# EasyEDA Pro project ProPrj_Inverted_MAML_6x6_2026-07-20.epro, schematic 8xDAC_WEIGHT
Create Date: 2026-06-15; Page Name: P1; Project Name: Inverted_MAML_6x6; Schematic Name: Schematic1; Update Date: 2026-06-15; Company: EasyEDA.com; Drawn: Olle Welin; Page Size: A4; Version: V1.0
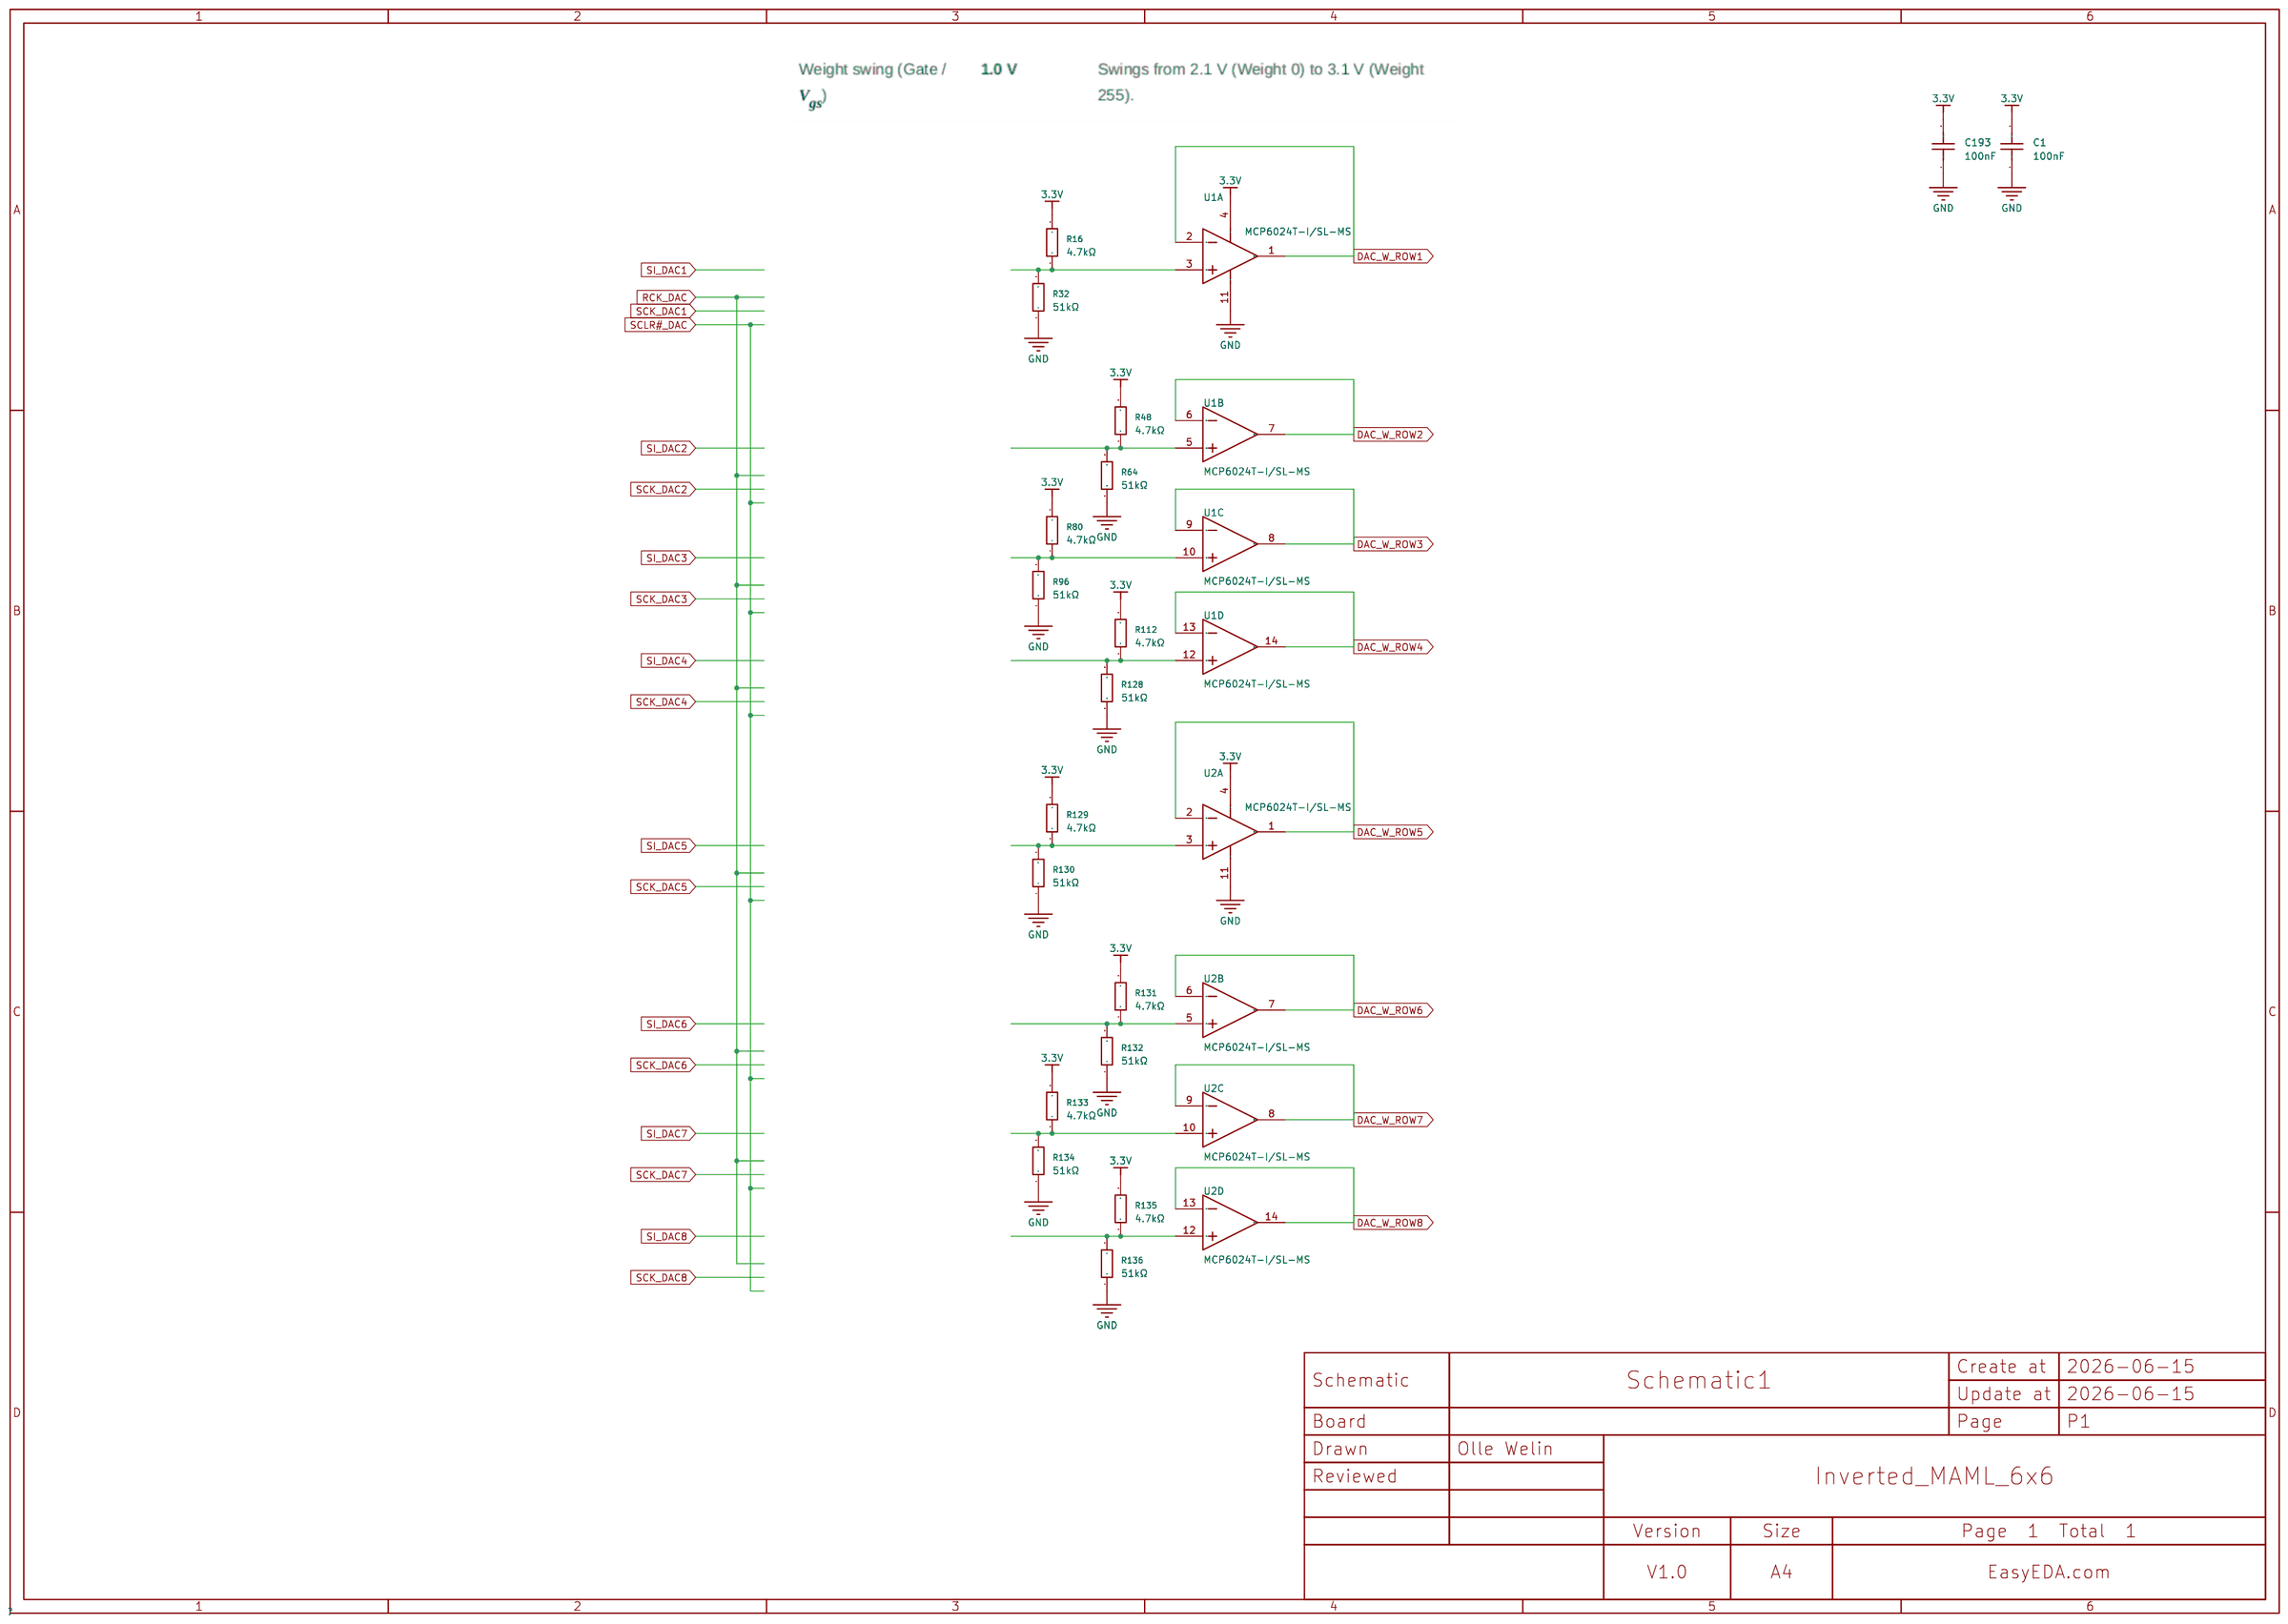
[diagram p8: schematic sheet]

## Parts
C1  100nF  [C0402]
C193  100nF  [C0402]
CBB1  -
CBB2  -
CBB3  -
CBB4  -
CBB5  -
CBB6  -
CBB7  -
CBB8  -
R16  4.7kΩ  [R0402]
R32  51kΩ  [R0402]
R48  4.7kΩ  [R0402]
R64  51kΩ  [R0402]
R80  4.7kΩ  [R0402]
R96  51kΩ  [R0402]
R112  4.7kΩ  [R0402]
R128  51kΩ  [R0402]
R129  4.7kΩ  [R0402]
R130  51kΩ  [R0402]
R131  4.7kΩ  [R0402]
R132  51kΩ  [R0402]
R133  4.7kΩ  [R0402]
R134  51kΩ  [R0402]
R135  4.7kΩ  [R0402]
R136  51kΩ  [R0402]
U1  MCP6024T-I/SL-MS  [SOIC-14_L8.7-W3.9-P1.27-LS6.0-BL-1]  (sections 1,2,3,4)
U2  MCP6024T-I/SL-MS  [SOIC-14_L8.7-W3.9-P1.27-LS6.0-BL-1]  (sections 1,2,3,4)

## Library data of the parts
C1 C193 = CL05B104KO5NNNC: Capacitance:100nF Tolerance:±10% Tolerance:±10% Voltage Rating:16V Temperature Coefficient:X7R; LCSC Part Name: 100nF ±10% 16V; Supplier Part: C1525; Manufacturer: SAMSUNG(三星); Supplier Footprint: 0402; JLCPCB Part Class: Basic Part; Datasheet: https://item.szlcsc.com/datasheet/CL05B104KO5NNNC/1877.html; Supplier: LCSC; Tolerance: ±10%; Voltage Rating: 16V; Temperature Coefficient: X7R
R16 R48 R80 R112 R129 R131 R133 R135 = 0402WGF4701TCE: Type:Thick Film Resistor Resistance:4.7kΩ Tolerance:±1% Tolerance:±1% Power(Watts):62.5mW Voltage-Supply(Max):50V Temperature Coefficient:±100ppm/℃ Temperature Coefficient:±100ppm/℃ Operating Temperature:-55℃~+155℃ Operating Temperature:-55℃~+155℃; LCSC Part Name: 4.7kΩ ±1% 62.5mW 厚膜电阻; Supplier Part: C25900; Manufacturer: UNI-ROYAL(厚声); Supplier Footprint: 0402; JLCPCB Part Class: Basic Part; Datasheet: https://item.szlcsc.com/datasheet/0402WGF4701TCE/26643.html; Supplier: LCSC; Type: Thick Film Resistor; Tolerance: ±1%; Power(Watts): 62.5mW; Voltage-Supply(Max): 50V; Temperature Coefficient: ±100ppm/℃; Operating Temperature: -55℃~+155℃
R32 R64 R96 R128 R130 R132 R134 R136 = 0402WGF5102TCE: Type:Thick Film Resistors Resistance:51kΩ Tolerance:±1% Tolerance:±1% Power(Watts): Overload Voltage (Max): Temperature Coefficient:±100ppm/℃ Temperature Coefficient:±100ppm/℃ Operating Temperature Range:-55℃~+155℃ Operating Temperature Range:-55℃~+155℃; LCSC Part Name: 51kΩ ±1% 62.5mW 厚膜电阻; Supplier Part: C25794; Manufacturer: UNI-ROYAL(厚声); Supplier Footprint: 0402; JLCPCB Part Class: Basic Part; Datasheet: https://atta.szlcsc.com/upload/public/pdf/source/20200306/C422600_1E6D84923E4A46A82E41ADD87F860B5C.pdf; Supplier: LCSC; Type: Thick Film Resistors; Tolerance: ±1%; Temperature Coefficient: ±100ppm/℃; Operating Temperature Range: -55℃~+155℃
U1 U2 = MCP6024T-I/SL-MS: Supplier Part: C54539958; Manufacturer: MSKSEMI(美森科); Supplier Footprint: SOP-14; JLCPCB Part Class: Extended Part; Datasheet: https://item.szlcsc.com/datasheet/MCP6024T-I%252FSL-MS/57895720.html; Supplier: LCSC

## Nets
3.3V: C1.2 C193.2 R16.2 R48.2 R80.2 R112.2 R129.2 R131.2 R133.2 R135.2 U1.4(V+) U2.4(V+)
GND: C1.1 C193.1 R32.1 R64.1 R96.1 R128.1 R130.1 R132.1 R134.1 R136.1 U1.11(V-) U2.11(V-)
DAC_W_ROW1: U1.1(OUT1) U1.2(IN1-)
DAC_W_ROW2: U1.6(IN2-) U1.7(OUT2)
DAC_W_ROW3: U1.8(OUT3) U1.9(IN3-)
DAC_W_ROW4: U1.13(IN4-) U1.14(OUT4)
DAC_W_ROW5: U2.1(OUT1) U2.2(IN1-)
DAC_W_ROW6: U2.6(IN2-) U2.7(OUT2)
DAC_W_ROW7: U2.8(OUT3) U2.9(IN3-)
DAC_W_ROW8: U2.13(IN4-) U2.14(OUT4)
RCK_DAC: CBB1.(DAC_LAD_OUT) CBB2.(DAC_LAD_OUT) CBB3.(DAC_LAD_OUT) CBB4.(DAC_LAD_OUT) CBB5.(DAC_LAD_OUT) CBB6.(DAC_LAD_OUT) CBB7.(DAC_LAD_OUT) CBB8.(DAC_LAD_OUT) R16.1 R32.2 R48.1 R64.2 R80.1 R96.2 R112.1 R128.2 R129.1 R130.2 R131.1 R132.2 R133.1 R134.2 R135.1 R136.2 U1.3(IN1+) U1.5(IN2+) U1.10(IN3+) U1.12(IN4+) U2.3(IN1+) U2.5(IN2+) U2.10(IN3+) U2.12(IN4+)
